# Altium schematic sheet HS0038_BOARD.SchDoc
size 420 x 297 mm; SheetNumber: 1; SheetTotal: 1
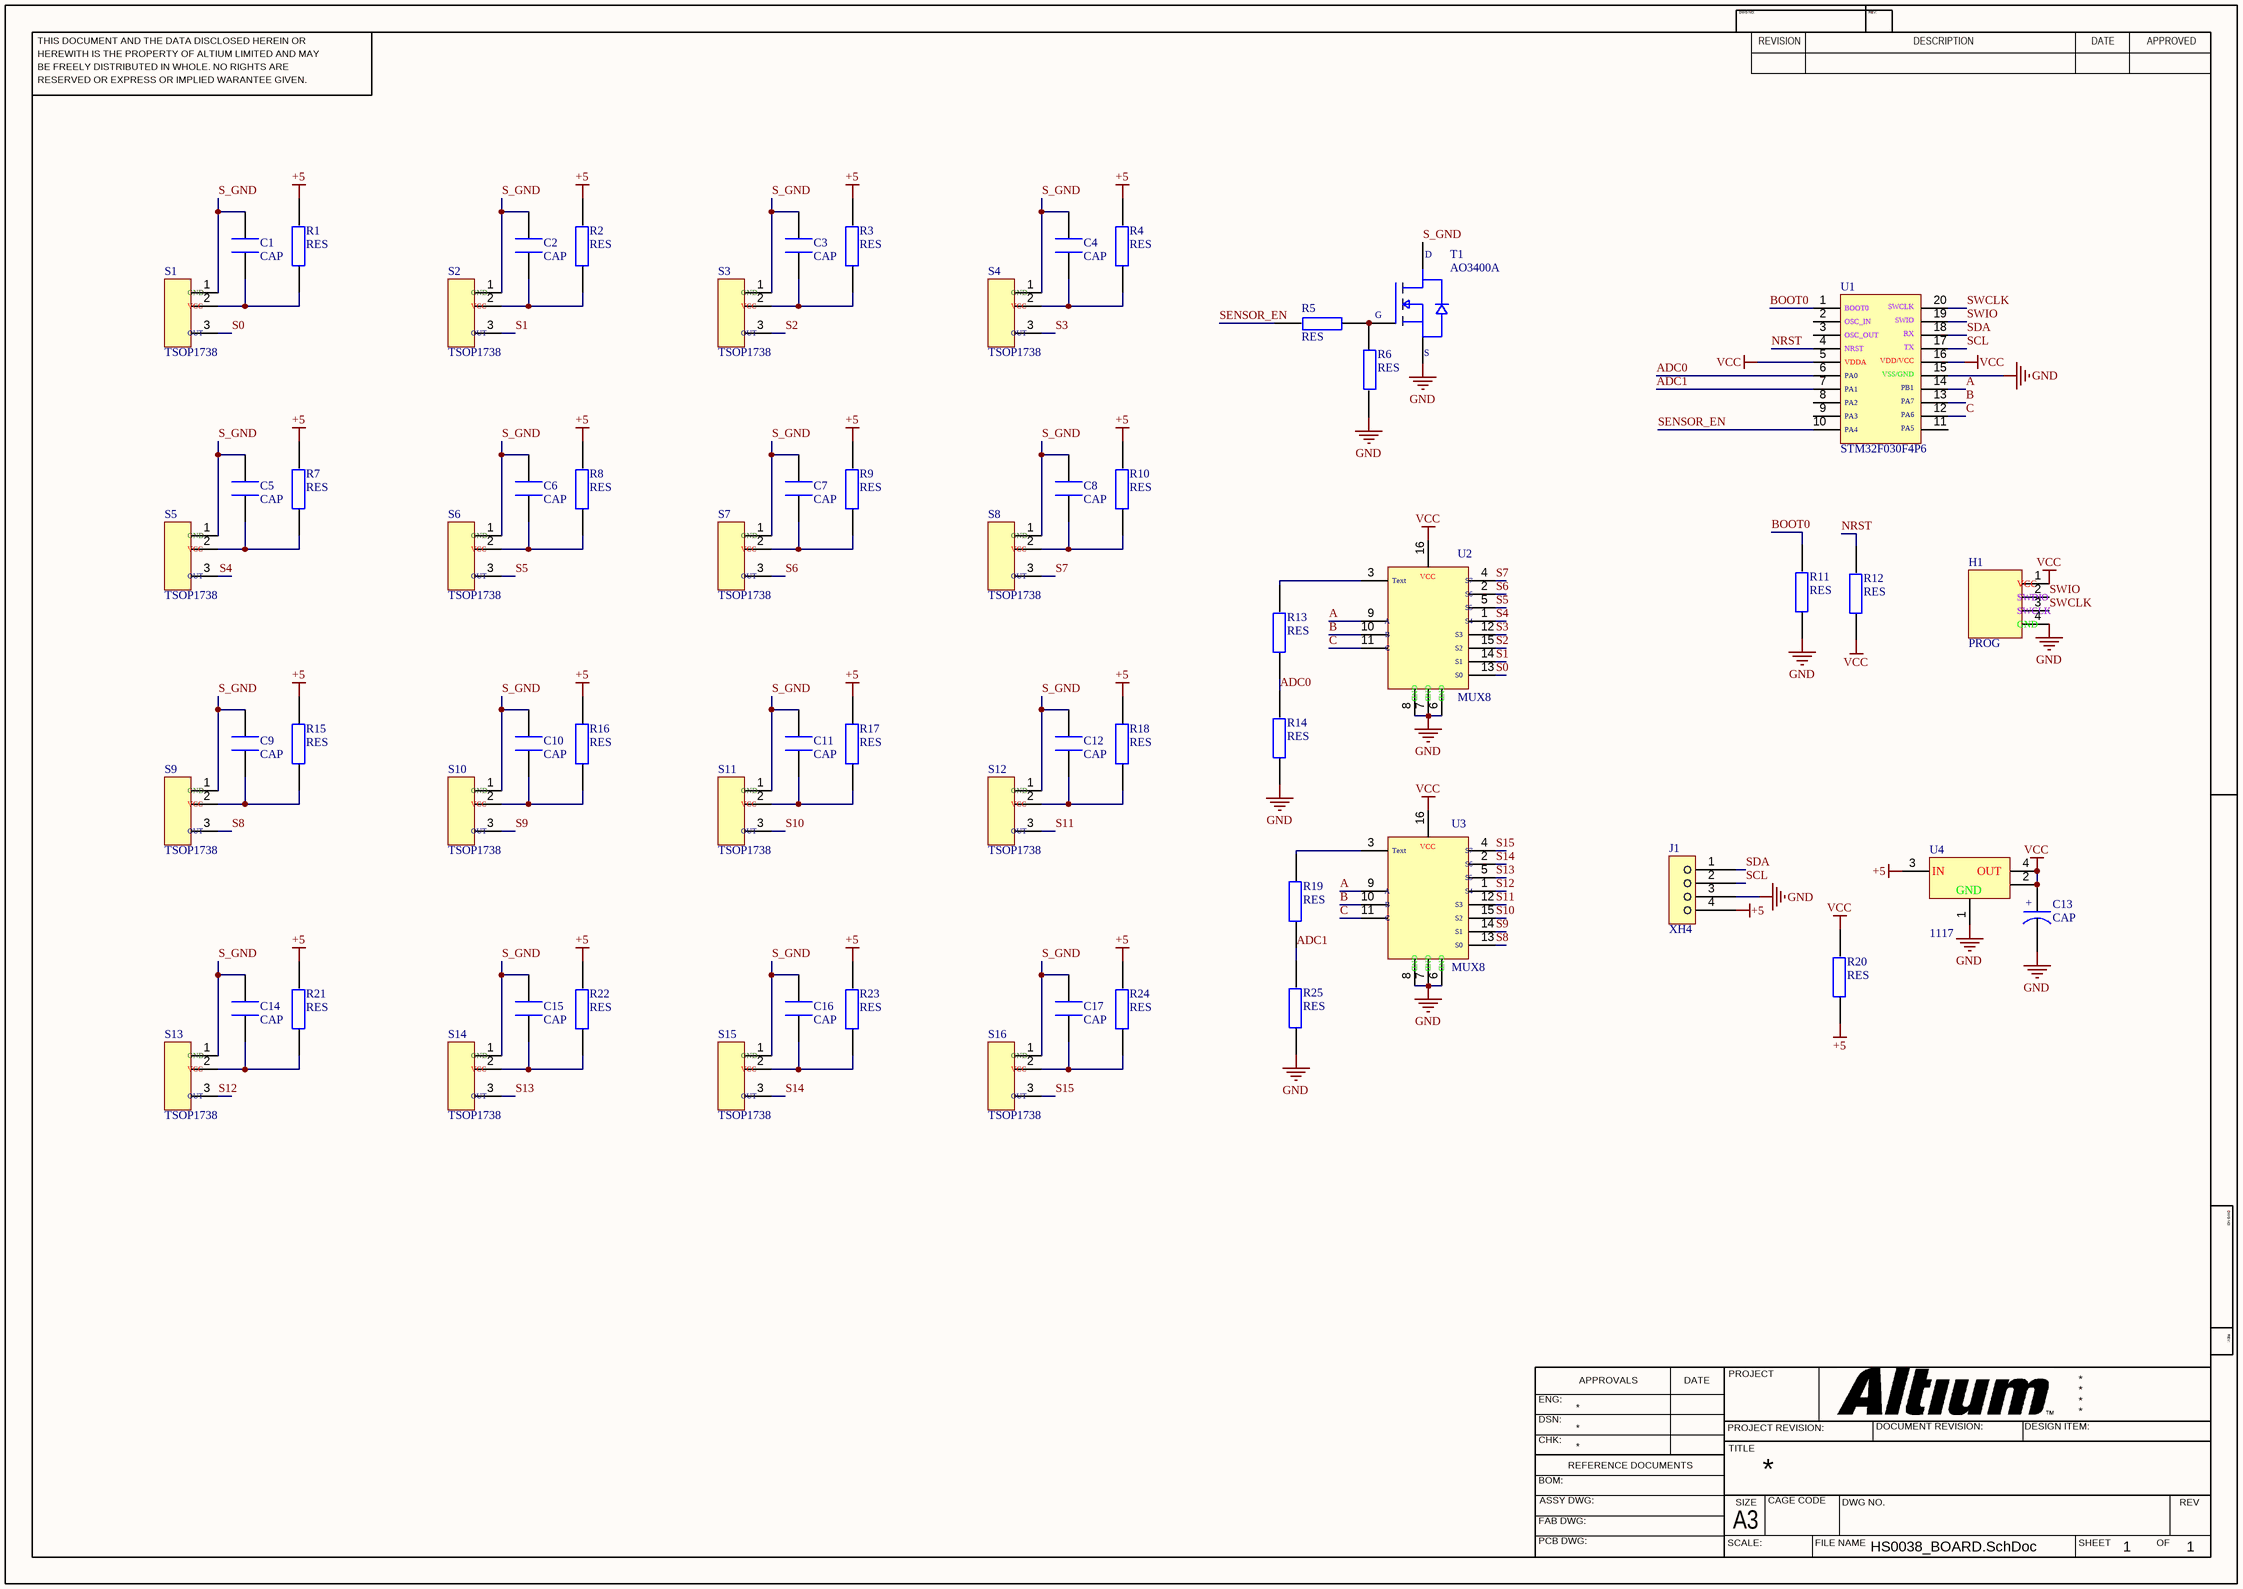
[diagram p0: HS0038_BOARD.SchDoc]

## Parts
C1  CAP  [CAP1206]
C2  CAP  [CAP1206]
C3  CAP  [CAP1206]
C4  CAP  [CAP1206]
C5  CAP  [CAP1206]
C6  CAP  [CAP1206]
C7  CAP  [CAP1206]
C8  CAP  [CAP1206]
C9  CAP  [CAP1206]
C10  CAP  [CAP1206]
C11  CAP  [CAP1206]
C12  CAP  [CAP1206]
C13  CAP  [CAP SMD 100uF 16V]
C14  CAP  [CAP1206]
C15  CAP  [CAP1206]
C16  CAP  [CAP1206]
C17  CAP  [CAP1206]
H1  PROG  [PROGRAMER]
J1  XH4  [XH 4PIN]
R1  RES  [RES805]
R2  RES  [RES805]
R3  RES  [RES805]
R4  RES  [RES805]
R5  RES  [RES1206]
R6  RES  [RES1206]
R7  RES  [RES805]
R8  RES  [RES805]
R9  RES  [RES805]
R10  RES  [RES805]
R11  RES  [RES1206]
R12  RES  [RES1206]
R13  RES  [RES1206]
R14  RES  [RES1206]
R15  RES  [RES805]
R16  RES  [RES805]
R17  RES  [RES805]
R18  RES  [RES805]
R19  RES  [RES1206]
R20  RES  [RES805]
R21  RES  [RES805]
R22  RES  [RES805]
R23  RES  [RES805]
R24  RES  [RES805]
R25  RES  [RES1206]
S1  TSOP1738  [TSOP1738]
S2  TSOP1738  [TSOP1738]
S3  TSOP1738  [TSOP1738]
S4  TSOP1738  [TSOP1738]
S5  TSOP1738  [TSOP1738]
S6  TSOP1738  [TSOP1738]
S7  TSOP1738  [TSOP1738]
S8  TSOP1738  [TSOP1738]
S9  TSOP1738  [TSOP1738]
S10  TSOP1738  [TSOP1738]
S11  TSOP1738  [TSOP1738]
S12  TSOP1738  [TSOP1738]
S13  TSOP1738  [TSOP1738]
S14  TSOP1738  [TSOP1738]
S15  TSOP1738  [TSOP1738]
S16  TSOP1738  [TSOP1738]
T1  AO3400A  [AO3400A]
U1  STM32F030F4P6  [STM32F030F4P6]
U2  MUX8  [4051 SMD]
U3  MUX8  [4051 SMD]
U4  1117  [AMS1117]

## Nets
+5: J1.4 R1.2 R2.2 R3.2 R4.2 R7.2 R8.2 R9.2 R10.2 R15.2 R16.2 R17.2 R18.2 R20.1 R21.2 R22.2 R23.2 R24.2 U4.3
GND: C13.1 H1.4 J1.3 R6.2 R11.1 R14.1 R25.1 T1.2 U1.15 U2.6 U2.7 U2.8 U3.6 U3.7 U3.8 U4.1
VCC: C13.2 H1.1 R12.1 R20.2 U1.5 U1.16 U2.16 U3.16 U4.2 U4.4
A: U1.14 U2.9 U3.9
ADC0: R13.1 R14.2 U1.6
ADC1: R19.1 R25.2 U1.7
B: U1.13 U2.10 U3.10
BOOT0: R11.2 U1.1
C: U1.12 U2.11 U3.11
NRST: R12.2 U1.4
S0: S1.3 U2.13
S1: S2.3 U2.14
S2: S3.3 U2.15
S3: S4.3 U2.12
S4: S5.3 U2.1
S5: S6.3 U2.5
S6: S7.3 U2.2
S7: S8.3 U2.4
S8: S9.3 U3.13
S9: S10.3 U3.14
S10: S11.3 U3.15
S11: S12.3 U3.12
S12: S13.3 U3.1
S13: S14.3 U3.5
S14: S15.3 U3.2
S15: S16.3 U3.4
S_GND: C1.2 C2.2 C3.2 C4.2 C5.2 C6.2 C7.2 C8.2 C9.2 C10.2 C11.2 C12.2 C14.2 C15.2 C16.2 C17.2 S1.1 S2.1 S3.1 S4.1 S5.1 S6.1 S7.1 S8.1 S9.1 S10.1 S11.1 S12.1 S13.1 S14.1 S15.1 S16.1 T1.3
SCL: J1.2 U1.17
SDA: J1.1 U1.18
SENSOR_EN: R5.2 U1.10
SWCLK: H1.3 U1.20
SWIO: H1.2 U1.19
NetC1_1: C1.1 R1.1 S1.2
NetC2_1: C2.1 R2.1 S2.2
NetC3_1: C3.1 R3.1 S3.2
NetC4_1: C4.1 R4.1 S4.2
NetC5_1: C5.1 R7.1 S5.2
NetC6_1: C6.1 R8.1 S6.2
NetC7_1: C7.1 R9.1 S7.2
NetC8_1: C8.1 R10.1 S8.2
NetC9_1: C9.1 R15.1 S9.2
NetC10_1: C10.1 R16.1 S10.2
NetC11_1: C11.1 R17.1 S11.2
NetC12_1: C12.1 R18.1 S12.2
NetC14_1: C14.1 R21.1 S13.2
NetC15_1: C15.1 R22.1 S14.2
NetC16_1: C16.1 R23.1 S15.2
NetC17_1: C17.1 R24.1 S16.2
NetR5_1: R5.1 R6.1 T1.1
NetR13_2: R13.2 U2.3
NetR19_2: R19.2 U3.3

Not connected (* = marked no-connect by the designer): U1 2 3 8 9 11

## Notes on the sheet
- THIS DOCUMENT AND THE DATA DISCLOSED HEREIN OR
- HEREWITH IS THE PROPERTY OF ALTIUM LIMITED AND MAY
- DWG NO:
- REVISION
- REV:
- DESCRIPTION
- DATE
- APPROVED
- BE FREELY DISTRIBUTED IN WHOLE. NO RIGHTS ARE
- RESERVED OR EXPRESS OR IMPLIED WARANTEE GIVEN.
- ENG:
- APPROVALS
- PROJECT
- DSN:
- CHK:
- REFERENCE DOCUMENTS
- PROJECT REVISION:
- TITLE
- DOCUMENT REVISION:
- DESIGN ITEM:
- BOM:
- FAB DWG:
- PCB DWG:
- ASSY DWG:
- SCALE:
- A3
- SIZE
- CAGE CODE
- FILE NAME
- DWG NO.
- SHEET
- OF
- REV
- (in symbol 4051) VCC; Text; S7; S6; S5; A; S4; B; S3; C; S2; S1; S0; GND
- (in symbol AMS1117) IN; OUT; GND
- (in symbol AO3400A) D; G; S
- (in symbol CAP Electrolit SMD) +
- (in symbol Programmer) VCC; SWDIO; SWCLK; GND
- (in symbol STM32F030F4P6) BOOT0; SWCLK; OSC_IN; SWIO; OSC_OUT; RX; NRST; TX; VDDA; VDD/VCC; PA0; VSS/GND; PA1; PB1; PA2; PA7; PA3; PA6; PA4; PA5
- (in symbol TSOP1738) GND; VCC; OUT

## Library data of the parts
C1-C12 C14-C17 = CAP1206: Capacitor SMD 1206
C13 = CAP Electrolit SMD: Capacitor Electrolit SMD
H1 = Programmer
J1 = XH 4PIN: XH Connector 4pins
R1-R4 R7-R10 R15-R18 R20-R24 = RES805: RESISTOR SMD
R5 R6 R11-R14 R19 R25 = RES1206: RESISTOR SMD
S1-S16 = TSOP1738: IR SENSOR
U2 U3 = 4051: MULTIPLEXER 8 BIT
U4 = AMS1117: 3.3v Regulator